# EAGLE design rotary jack (EAGLE 7.3.0)
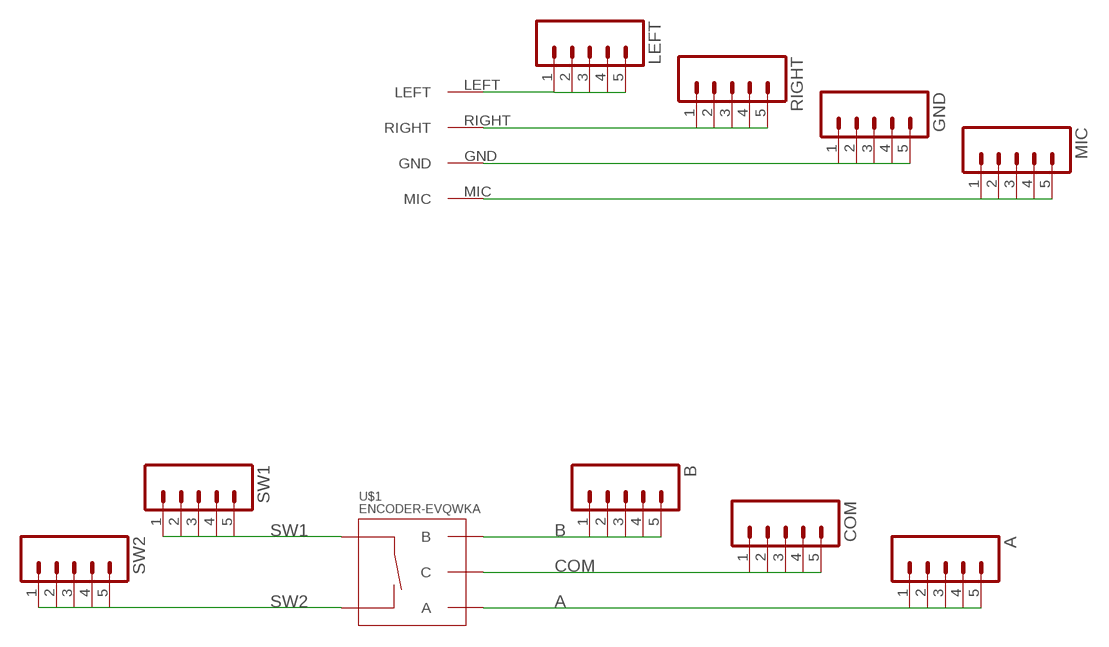
[diagram p0: schematic, sheet 1]

## Parts
A  M05NO_SILK  [1X05_NO_SILK]
B  M05NO_SILK  [1X05_NO_SILK]
COM  M05NO_SILK  [1X05_NO_SILK]
GND  M05NO_SILK  [1X05_NO_SILK]
LEFT  M05NO_SILK  [1X05_NO_SILK]
MIC  M05NO_SILK  [1X05_NO_SILK]
RIGHT  M05NO_SILK  [1X05_NO_SILK]
SW1  M05NO_SILK  [1X05_NO_SILK]
SW2  M05NO_SILK  [1X05_NO_SILK]
U$1  ENCODER-EVQWKA  [ENCODER-EVQWKA]
U$2  MALE-HEADPHONEMIC  [MALEHEADPHONE]

## Nets
A: A.1 A.2 A.3 A.4 A.5 U$1.A
B: B.1 B.2 B.3 B.4 B.5 U$1.B
COM: COM.1 COM.2 COM.3 COM.4 COM.5 U$1.COM(C)
GND: GND.1 GND.2 GND.3 GND.4 GND.5 U$2.GND
N$1: LEFT.1 LEFT.2 LEFT.3 LEFT.4 LEFT.5 U$2.LEFT
N$2: RIGHT.1 RIGHT.2 RIGHT.3 RIGHT.4 RIGHT.5 U$2.RIGHT
N$4: MIC.1 MIC.2 MIC.3 MIC.4 MIC.5 U$2.MIC
SW1: SW1.1 SW1.2 SW1.3 SW1.4 SW1.5 U$1.SW1(SW+)
SW2: SW2.1 SW2.2 SW2.3 SW2.4 SW2.5 U$1.SW2(SW-)

## Library data of the parts
A B COM GND LEFT MIC RIGHT SW1 SW2 = SparkFun-Connectors:M05: Header 5 Standard 5-pin 0.1" header. Use with straight break away headers (SKU : PRT-00116), right angle break away headers (PRT-00553), swiss pins (PRT-00743), machine pins (PRT-00117), and female headers (PRT-00115). Molex polarized connector foot print use with SKU : PRT-08230 with associated crimp pins and housings.
U$1 = cw:ENCODER-EVQWKA
U$2 = cw:MALE-HEADPHONEMIC

## Board
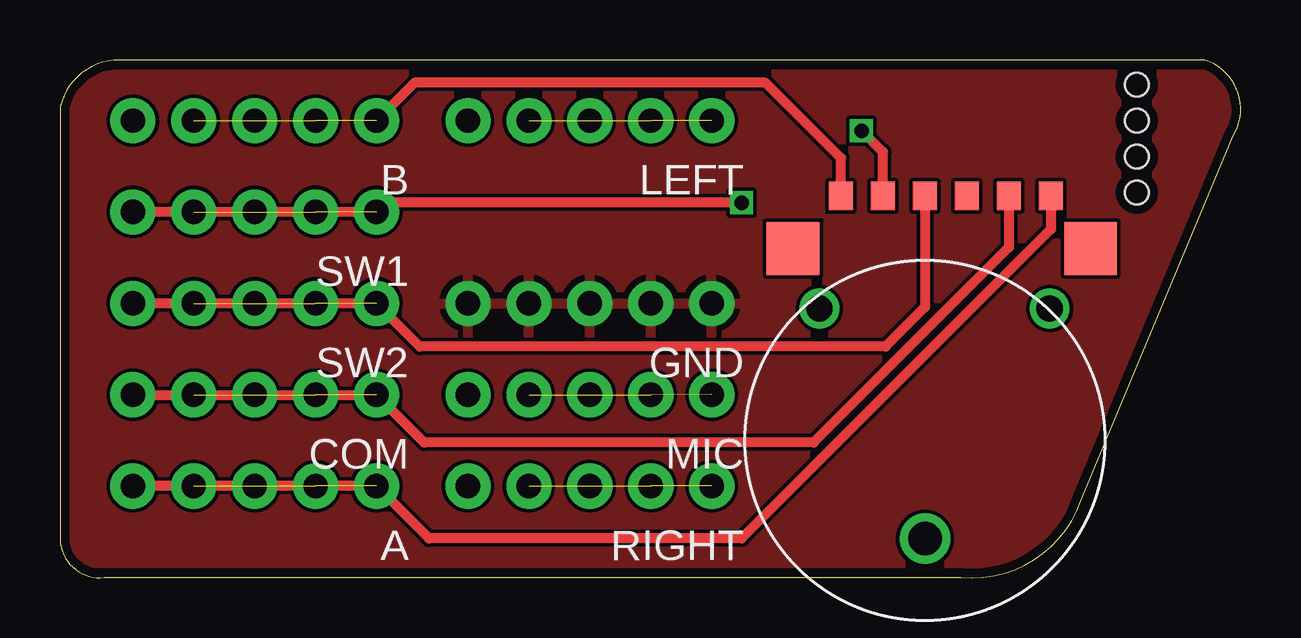
[diagram p1: board, top side]
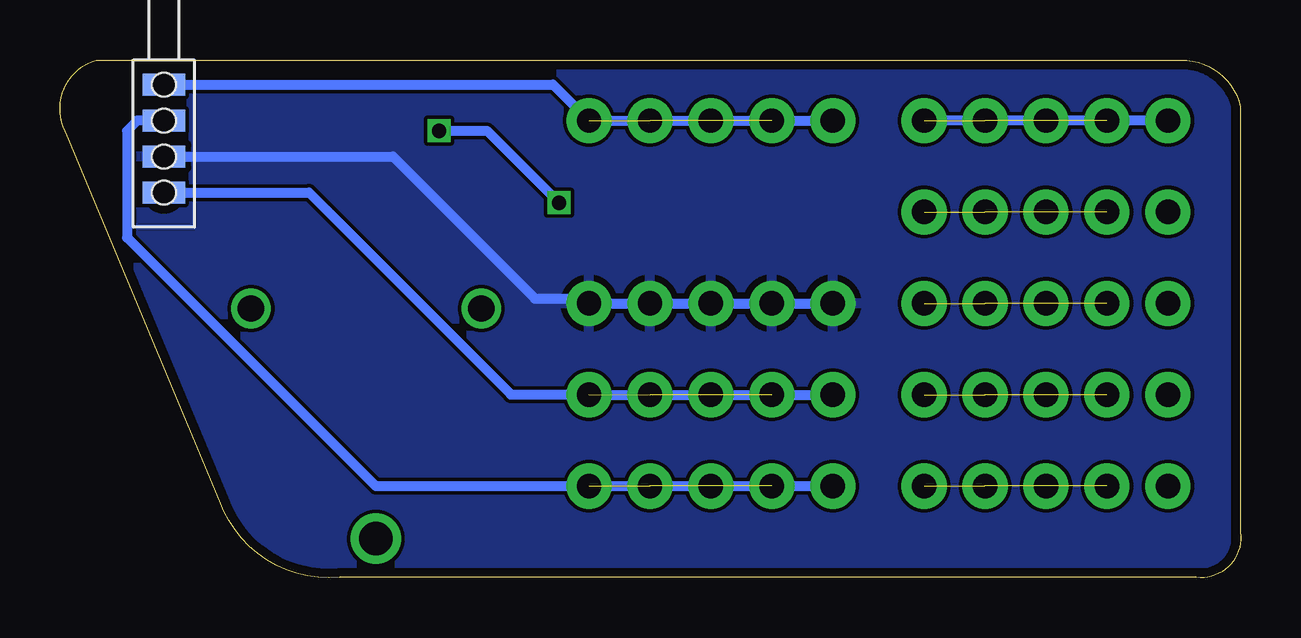
[diagram p2: board, bottom side, seen from below]

Size 49.22 x 21.6 mm. Coordinates in mm from the lower left corner, seen from the top.
Outline: 0.01,19.68 0.01,1.91 arc104 1.84,0.02 37.55,0.02 arc76 42.56,3.22 48.91,18.45 arc104 47.71,21.6 2.48,21.6 arc76 0.01,19.68
Copper layers (1*16): Top 0.0356mm / dielectric 1.5011mm / Bottom 0.0356mm
Design rules "LaenPCBOrder *": minimum track width 6mil, minimum drill 13mil, track to track 6mil, track to pad 6mil, pad to pad 6mil, via to via 6mil, smd to smd 6mil, copper to edge 15mil, drill to drill 6mil, minimum pad ring 7mil, minimum via ring 7mil, stop-mask expansion 3mil, vias tented up to drill 7mil, thermal gap 10mil

### Footprints (pad centres in the part's own frame; a part is rotated, then mirrored left to right if it is on the bottom)
1X05_NO_SILK = drill 1.016 pad 1.88: 1 0,0; 2 2.54,0; 3 5.08,0; 4 7.62,0; 5 10.16,0
ENCODER-EVQWKA = smd 1 x 1.2: A -5.25,-10.2; B 3.5,-10.2; COM -3.5,-10.2; SW1 1.75,-10.2; SW1A' -1.75,-10.2; SW2 0,-10.2 | drill 1.1 pad 1.1: P$1 4.4,-5.5; P$2 -5.2,-5.5 | drill 1.4 pad 1.4: P$3 0,4.1 | smd 2.2 x 2.2: P$10 -6.9,-8; P$11 5.5,-8
MALEHEADPHONE = smd 0.914 x 1.778: GND 1.5,0; LEFT -1.5,0; MIC 3,0; RIGHT 0,0 | hole 1: -1.5,0; 3,0; 0,0; 1.5,0

### Placement (x,y rotation side)
A  13.2,3.83 180 top
B  13.2,19.07 180 top
COM  13.2,7.64 180 top
GND  27.17,11.45 180 top
LEFT  27.17,19.07 180 top
MIC  27.17,7.64 180 top
RIGHT  27.17,3.83 180 top
SW1  13.2,15.26 180 top
SW2  13.2,11.45 180 top
U$1  36.06,5.74 180 top
U$2  44.89,19.07 270 bottom

### Tracks (layer width: path | path; a pad name or v marks a point on that pad's centre or on a via)
A  (3 unrouted)
  Top 0.406: U$1.A 41.31,14.54 28.42,1.65 15.38,1.65 A.1 A.5
B  (3 unrouted)
  Top 0.406: U$1.B 32.56,17.51 29.42,20.65 14.78,20.65 B.1
  Bottom 0.406: B.5 B.1
COM  (3 unrouted)
  Top 0.406: U$1.COM 39.56,13.79 31.42,5.65 15.19,5.65 COM.1 COM.5
GND
  Bottom 0.406: U$2.GND 35.34,17.57 29.42,11.65 27.37,11.65 GND.1 GND.5
  pour Bottom: -2.58,24.65 52.42,24.65 52.42,-3.35 -2.58,-3.35
  pour Top: -0.58,22.65 50.42,22.65 50.42,-1.35 -0.58,-1.35
N$1  (3 unrouted)
  Bottom 0.406: U$2.LEFT 28.67,20.57 LEFT.1 LEFT.5
N$2  (3 unrouted)
  Bottom 0.406: U$2.RIGHT 46,19.07 46.42,18.65 46.42,14.19 36.06,3.83 RIGHT.1 RIGHT.5
N$4  (3 unrouted)
  Bottom 0.406: U$2.MIC 38.84,16.07 30.42,7.65 MIC.1 MIC.5
SW1  (via drill 0.6)  (3 unrouted)
  Top 0.406: U$1.SW1 34.31,17.76 v33.42,18.65 | v28.42,15.65 13.59,15.65 SW1.1 SW1.5
  Bottom 0.406: v33.42,18.65 31.42,18.65 v28.42,15.65
SW2  (3 unrouted)
  Top 0.406: U$1.SW2 36.06,11.29 34.42,9.65 15,9.65 SW2.1 SW2.5